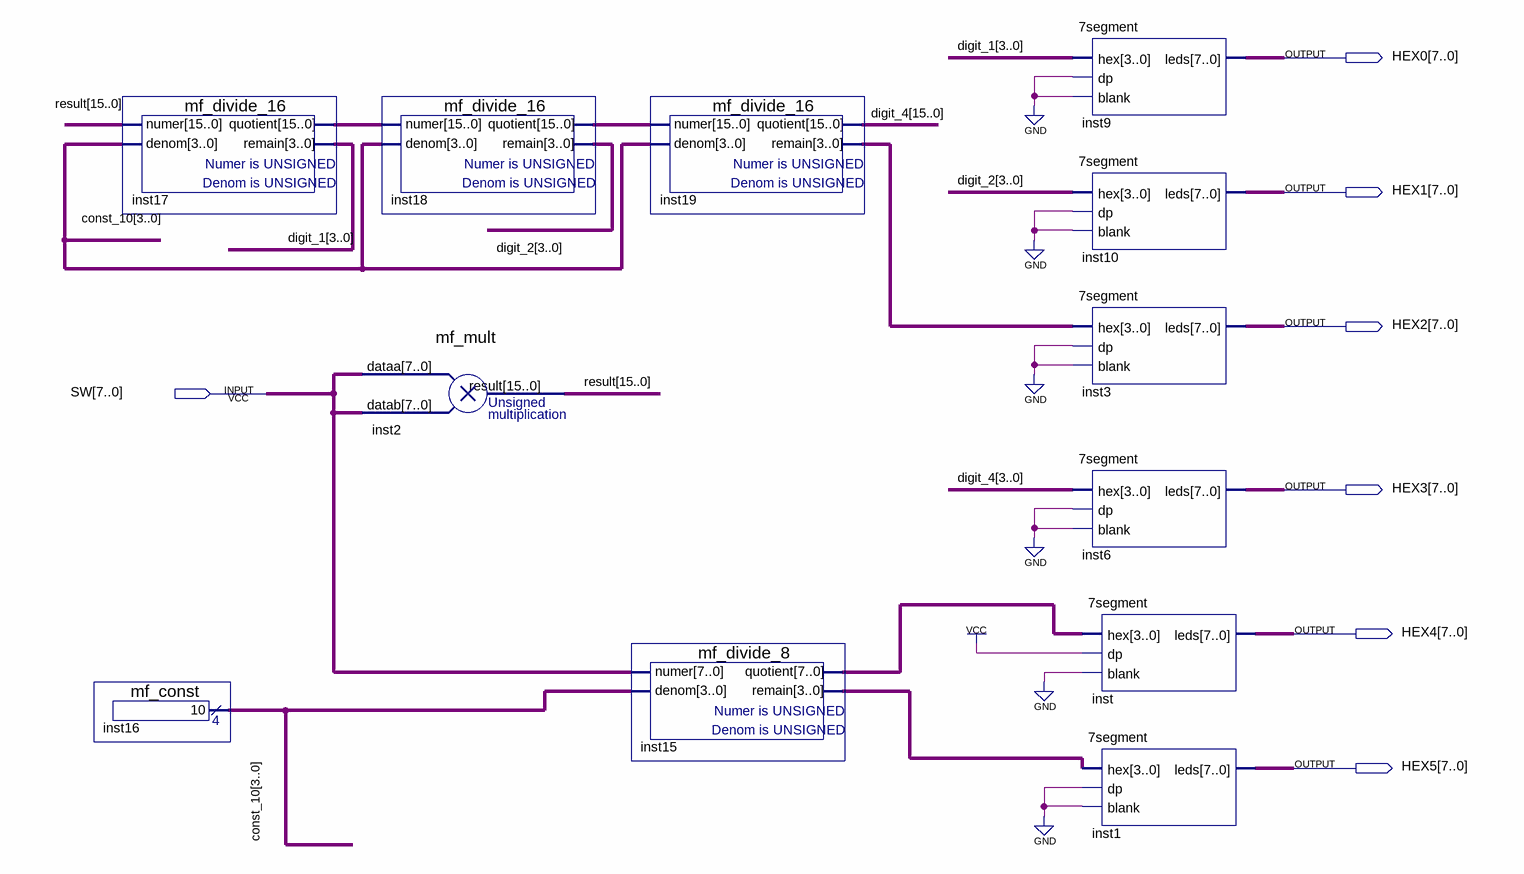
[diagram p0: schematic sheet]
// Quartus schematic LEDtest.bdf as structural Verilog: 12 symbols, 7 pins
module LEDtest (
  input  [7:0] SW,
  output [7:0] HEX0,
  output [7:0] HEX1,
  output [7:0] HEX2,
  output [7:0] HEX3,
  output [7:0] HEX4,
  output [7:0] HEX5
);

  wire [3:0] const_10, digit_1, digit_2, inst15_remain, inst19_remain;
  wire [7:0] inst15_quotient;
  wire [15:0] digit_4, inst17_quotient, inst18_quotient, result;

  mf_const inst16 (.result(const_10));
  mf_divide_16 inst17 (.numer(result), .denom(const_10), .quotient(inst17_quotient), .remain(digit_1));
  mf_divide_16 inst18 (.numer(inst17_quotient), .denom(const_10), .quotient(inst18_quotient), .remain(digit_2));
  mf_mult inst2 (.dataa(SW), .datab(SW), .result(result));
  mf_divide_8 inst15 (.numer(SW), .denom(const_10), .quotient(inst15_quotient), .remain(inst15_remain));
  mf_divide_16 inst19 (.numer(inst18_quotient), .denom(const_10), .quotient(digit_4), .remain(inst19_remain));
  \7segment  inst9 (.hex(digit_1), .dp(1'b0), .blank(1'b0), .leds(HEX0));
  \7segment  inst10 (.hex(digit_2), .dp(1'b0), .blank(1'b0), .leds(HEX1));
  \7segment  inst3 (.hex(inst19_remain), .dp(1'b0), .blank(1'b0), .leds(HEX2));
  \7segment  inst6 (.hex(digit_4[3:0]), .dp(1'b0), .blank(1'b0), .leds(HEX3));
  \7segment  inst (.hex(inst15_quotient), .dp(1'b1), .blank(1'b0), .leds(HEX4));
  \7segment  inst1 (.hex(inst15_remain), .dp(1'b0), .blank(1'b0), .leds(HEX5));
endmodule
